# Altium schematic sheet Camera Module.SchDoc
size A
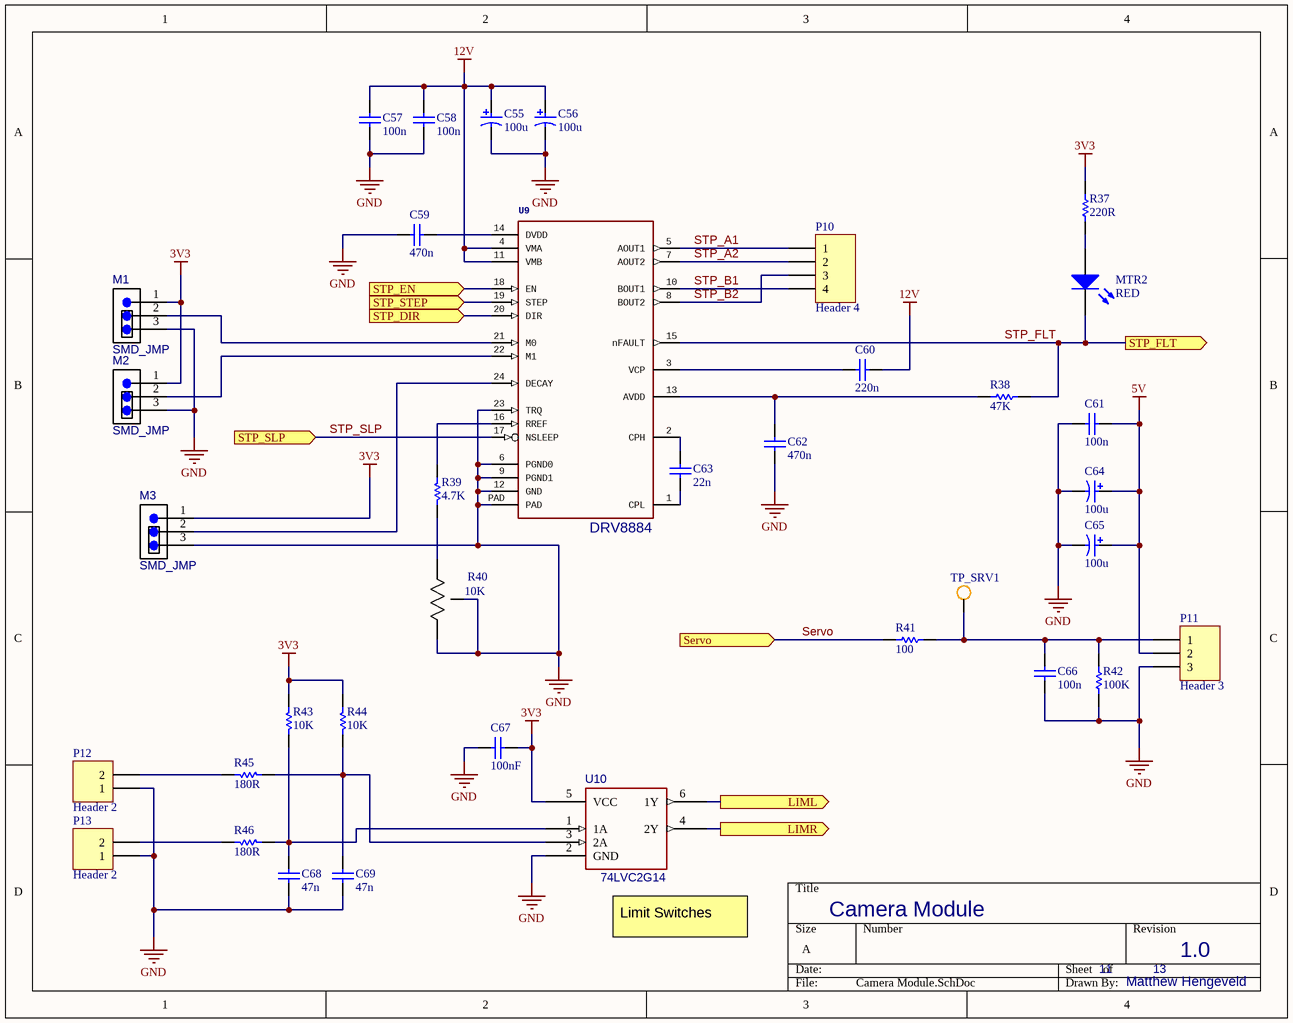
[diagram p0: Camera Module.SchDoc]

## Parts
C55  100u  [SMD-CAP-0606]
C56  100u  [SMD-CAP-0606]
C57  100n  [CAPC1608X87X35LL15T15]
C58  100n  [CAPC1608X87X35LL15T15]
C59  470n  [CAPC1608X87X35LL15T15]
C60  220n  [CAPC1608X87X35LL15T15]
C61  100n  [CAPC1608X87X35LL15T15]
C62  470n  [CAPC1608X90X35LL10T15]
C63  22n  [CAPC1608X87X35LL15T15]
C64  100u  [SMD-CAP-0606]
C65  100u  [SMD-CAP-0606]
C66  100n  [CAPC1608X90X35LL10T15]
C67  100nF  [CAPC1608X92X38LL15T08]
C68  47n  [CAPC1608X87X35LL15T15]
C69  47n  [CAPC1608X87X35LL15T15]
M1  SMD_JMP  [0603_JUMPER]
M2  SMD_JMP  [0603_JUMPER]
M3  SMD_JMP  [0603_JUMPER]
MTR2  RED  [0805_A]
P10  Header 4  [HDR1X4]
P11  Header 3  [HDR1X3]
P12  Header 2  [HDR1X2]
P13  Header 2  [HDR1X2]
R37  220R  [RESC1608X55X30LL15T15]
R38  47K  [RESC1608X55X30LL15T15]
R39  4.7K  [RESC1608X55X30LL15T15]
R40  10K  [TRIMMER-TC33]
R41  100  [RESC1608X55X30LL15T15]
R42  100K  [RESC1608X55X30LL15T15]
R43  10K  [RESC1608X55X30LL15T15]
R44  10K  [RESC1608X55X30LL15T15]
R45  180R  [RESC1608X55X30LL15T15]
R46  180R  [RESC1608X55X30LL15T15]
TP_SRV1  Test point  [SMD Test Hook]  (value not drawn)
U9  DRV8884  [TI-PWP24]  (value not drawn)
U10  74LVC2G14  [ONSC-SOT-363-6-419B-02_V]  (value not drawn)

## Ports
LIML (out), LIMR (out), Servo (in), STP_DIR (in), STP_EN (in), STP_FLT (out), STP_SLP (in), STP_STEP (in)

## Nets
3V3: C67.2 M1.1 M2.1 M3.1 R37.1 R43.1 R44.1 U10.5(VCC)
5V: C61.1 C64.1 C65.1 P11.2
12V: C55.1 C56.1 C57.2 C58.2 C60.1 U9.4(VMA) U9.11(VMB)
GND: C55.2 C56.2 C57.1 C58.1 C59.2 C61.2 C62.1 C64.2 C65.2 C66.1 C67.1 C68.2 C69.2 M1.3 M2.3 M3.3 P11.3 P12.1 P13.1 R40.2 R40.3 R42.2 U9.6(PGND0) U9.9(PGND1) U9.12(GND) U9.23(TRQ) U9.PAD U10.2(GND)
LIML: U10.6(1Y) ; port LIML
LIMR: U10.4(2Y) ; port LIMR
Servo: R41.2 ; port Servo
STP_A1: P10.1 U9.5(AOUT1)
STP_A2: P10.2 U9.7(AOUT2)
STP_B1: P10.4 U9.10(BOUT1)
STP_B2: P10.3 U9.8(BOUT2)
STP_DIR: U9.20(DIR) ; port STP_DIR
STP_EN: U9.18(EN) ; port STP_EN
STP_FLT: MTR2.1(K) R38.2 U9.15(nFAULT) ; port STP_FLT
STP_SLP: U9.17(NSLEEP) ; port STP_SLP
STP_STEP: U9.19(STEP) ; port STP_STEP
NetC59_1: C59.1 U9.14(DVDD)
NetC60_2: C60.2 U9.3(VCP)
NetC62_2: C62.2 R38.1 U9.13(AVDD)
NetC63_1: C63.1 U9.1(CPL)
NetC63_2: C63.2 U9.2(CPH)
NetC66_2: C66.2 P11.1 R41.1 R42.1 TP_SRV1.1(point)
NetC68_1: C68.1 R43.2 R46.2 U10.1(1A)
NetC69_1: C69.1 R44.2 R45.2 U10.3(2A)
NetM1_2: M1.2 U9.21(M0)
NetM2_2: M2.2 U9.22(M1)
NetM3_2: M3.2 U9.24(DECAY)
NetMTR2_2: MTR2.2(A) R37.2
NetP12_2: P12.2 R45.1
NetP13_2: P13.2 R46.1
NetR39_1: R39.1 U9.16(RREF)
NetR39_2: R39.2 R40.1

## Notes on the sheet
- (near U9) DRV8884
- (near U10) Limit Switches
- Camera Module
- 11
- 13
- 1.0
- Matthew Hengeveld

## Library data of the parts
C55 C56 C64 C65 = CAP-EL-0606-SMD: Aluminum Electrolytic Capacitor, UD Series, Low Impedance, 100 uF, 35 V, + / - 20%, -55 to 105 degC, Chip Type, 8 x 10 mm D x L, Pb-Free, Reel; PartNumber: UUD1V101MNL1GS; Manufacturer: Nichicon; Rated Ripple Current (at 100kHz): 450 mA; Packing: Dia382mm Reel; Endurance Time: 5000 h; Impedance: 0.17 Ohm; Rated Voltage: 35 V; Rated Capacitance: 100 uF; Tolerance Rated Capacitance: -20 to 20%; ComponentLink2URL: http://products.nichicon.co.jp/en/pdf/XJA043/e-ud.pdf; DatasheetVersion: 08/2012; ComponentLink1Description: Manufacturer URL; Diameter: 8 mm; RoHS: TRUE; ComponentLink3Description: Package Specification; Mounting Technology: Surface Mount; ComponentLink3URL: http://products.nichicon.co.jp/en/pdf/XJA043/e-ud.pdf; Length: 10 mm; PackageReference: CAPAE-D8H10; ComponentLink1URL: http://www.nichicon.co.jp/; ComponentLink2Description: Datasheet; PackageDescription: 2-Pin Surface Mount Device, Diameter 8 mm, Height 10 mm, Pitch 6.5 mm
C57-C61 C68 C69 = CMP-2006-03300-1: Part Number: C0603X104K5RACTU; Manufacturer: Kemet
C62 C66 = CMP-2006-02860-1: Manufacturer: Murata; Part Number: GRM188R71C474KA88D
C63 = CMP-2006-03036-1: Manufacturer: Kemet; Part Number: C0603C103K1RACTU
C67 = CMP-2006-01974-1: Part Number: VJ0603Y104KNXAO; Manufacturer: Vitramon
MTR2 = CMP-1426-00011-1: SMD mono-color Chip LED, WL-SMCW, Red; PartNumber: 150080RS75000; Manufacturer: Wuerth Elektronik; Color: Red; PackageReference: 0805_A; ComponentLink2Description: Datasheet; ComponentLink1URL: http://www.we-online.com; ComponentLink1Description: Manufacturer URL; ComponentLink2URL: http://katalog.we-online.com/led/datasheet/150080RS75000.pdf
P10 = Header 4: Header, 4-Pin; LatestRevisionDate: 17-Jul-2002; LatestRevisionNote: Re-released for DXP Platform.; Publisher: Altium Limited
P11 = Header 3: Header, 3-Pin; LatestRevisionDate: 17-Jul-2002; LatestRevisionNote: Re-released for DXP Platform.; Publisher: Altium Limited
P12 P13 = Header 2: Header, 2-Pin; LatestRevisionDate: 17-Jul-2002; LatestRevisionNote: Re-released for DXP Platform.; Publisher: Altium Limited
R37-R39 R41-R46 = CMP-2000-00704-1: Manufacturer: Panasonic; Part Number: ERJ-3GEYJ103V
R40 = Trimmer
U9 = DRV8884: GateName_1: G$1; SymbolName_1: DRV8843; LibraryName: DRV88xx; DeviceSetName: DRV8843; Package: HTSSOP28PWP